# EAGLE design switching (EAGLE 7.2.0)
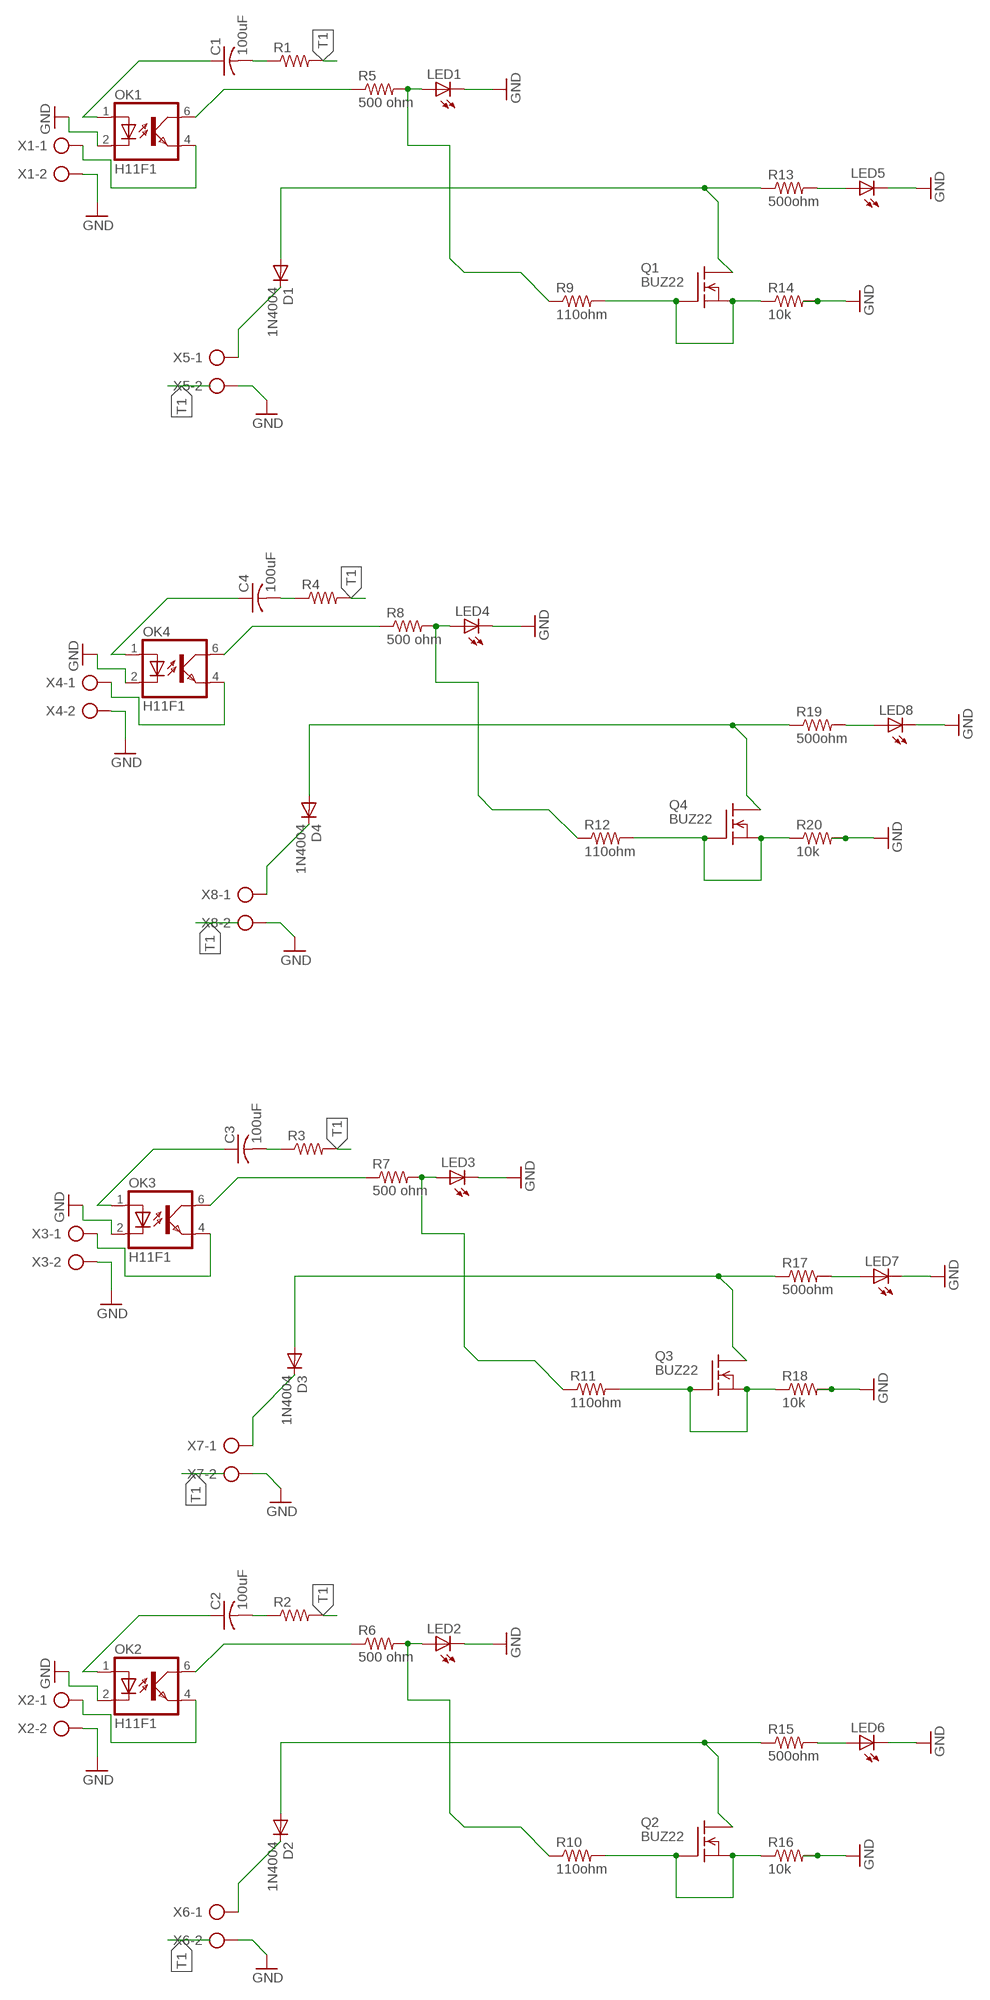
[diagram p0: schematic, sheet 1]

## Parts
C1  100uF  C-US025-024X044  [C025-024X044]
C2  100uF  C-US025-024X044  [C025-024X044]
C3  100uF  C-US025-024X044  [C025-024X044]
C4  100uF  C-US025-024X044  [C025-024X044]
D1  1N4004  [DO41-10]
D2  1N4004  [DO41-10]
D3  1N4004  [DO41-10]
D4  1N4004  [DO41-10]
LED1  LED3MM  [LED3MM]
LED2  LED3MM  [LED3MM]
LED3  LED3MM  [LED3MM]
LED4  LED3MM  [LED3MM]
LED5  LED3MM  [LED3MM]
LED6  LED3MM  [LED3MM]
LED7  LED3MM  [LED3MM]
LED8  LED3MM  [LED3MM]
OK1  H11F1  [DIL05]
OK2  H11F1  [DIL05]
OK3  H11F1  [DIL05]
OK4  H11F1  [DIL05]
Q1  BUZ22  [TO220]
Q2  BUZ22  [TO220]
Q3  BUZ22  [TO220]
Q4  BUZ22  [TO220]
R1  R-US_0204/7  [0204/7]
R2  R-US_0204/7  [0204/7]
R3  R-US_0204/7  [0204/7]
R4  R-US_0204/7  [0204/7]
R5  500 ohm  R-US_0204/7  [0204/7]
R6  500 ohm  R-US_0204/7  [0204/7]
R7  500 ohm  R-US_0204/7  [0204/7]
R8  500 ohm  R-US_0204/7  [0204/7]
R9  110ohm  R-US_0204/7  [0204/7]
R10  110ohm  R-US_0204/7  [0204/7]
R11  110ohm  R-US_0204/7  [0204/7]
R12  110ohm  R-US_0204/7  [0204/7]
R13  500ohm  R-US_0204/7  [0204/7]
R14  10k  R-US_0204/7  [0204/7]
R15  500ohm  R-US_0204/7  [0204/7]
R16  10k  R-US_0204/7  [0204/7]
R17  500ohm  R-US_0204/7  [0204/7]
R18  10k  R-US_0204/7  [0204/7]
R19  500ohm  R-US_0204/7  [0204/7]
R20  10k  R-US_0204/7  [0204/7]
X1  AK500/2  [AK500/2]
X2  AK500/2  [AK500/2]
X3  AK500/2  [AK500/2]
X4  AK500/2  [AK500/2]
X5  AK500/2  [AK500/2]
X6  AK500/2  [AK500/2]
X7  AK500/2  [AK500/2]
X8  AK500/2  [AK500/2]

## Nets
GND: LED1.K(C) LED2.K(C) LED3.K(C) LED4.K(C) LED5.K(C) LED6.K(C) LED7.K(C) LED8.K(C) OK1.2(C) OK2.2(C) OK3.2(C) OK4.2(C) R14.2 R16.2 R18.2 R20.2 X1.2 X2.2 X3.2 X4.2 X5.2 X6.2 X7.2 X8.2
N$1: OK3.4(EMIT) X3.1
N$2: OK3.6(COL) R7.1
N$3: C3.1 OK3.1(A)
N$4: LED3.A R7.2 R11.1
N$5: Q3.1(G) Q3.3(S) R11.2 R18.1
N$6: D3.A Q3.2(D) R17.1
N$7: LED7.A R17.2
N$8: D3.C X7.1
N$9: OK2.4(EMIT) X2.1
N$10: C3.2 R3.1
N$11: C2.1 OK2.1(A)
N$12: OK2.6(COL) R6.1
N$13: LED2.A R6.2 R10.1
N$14: Q2.1(G) Q2.3(S) R10.2 R16.1
N$15: D2.A Q2.2(D) R15.1
N$16: LED6.A R15.2
N$17: D2.C X6.1
N$18: C2.2 R2.1
N$19: OK4.4(EMIT) X4.1
N$20: C4.1 OK4.1(A)
N$21: OK4.6(COL) R8.1
N$22: LED4.A R8.2 R12.1
N$23: Q4.1(G) Q4.3(S) R12.2 R20.1
N$24: D4.A Q4.2(D) R19.1
N$25: LED8.A R19.2
N$26: D4.C X8.1
N$27: C4.2 R4.1
N$28: OK1.4(EMIT) X1.1
N$29: C1.1 OK1.1(A)
N$30: OK1.6(COL) R5.1
N$31: LED1.A R5.2 R9.1
N$32: Q1.1(G) Q1.3(S) R9.2 R14.1
N$33: D1.A Q1.2(D) R13.1
N$34: LED5.A R13.2
N$35: D1.C X5.1
N$36: C1.2 R1.1
T1: R1.2 R2.2 R3.2 R4.2

## Library data of the parts
C1-C4 = adafruit:C-US: CAPACITOR, American symbol; MF: AVX; MPN: 08055C104KAT2A; OC_FARNELL: 499687
D1-D4 = adafruit:1N4004: DIODE General purpose 1N400x type rectifier (With bigger pads) http://www.ladyada.net/library/pcb/eaglelibrary.html; MF: ON SEMICONDUCTOR; MPN: 1N4004G; OC_FARNELL: 1651084
LED1-LED8 = adafruit:LED: LED OSRAM: - CHIPLED LG R971, LG N971, LY N971, LG Q971, LY Q971, LO R971, LY R971 LH N974, LH R974 LS Q976, LO Q976, LY Q976 LO Q996 - Hyper CHIPLED LW Q18S LB Q993, LB Q99A, LB R99A - SideLED LS A670, LO A670, LY A670, LG A670, LP A670 LB A673, LV A673, LT A673, LW A673 LH A674 LY A675 LS A676, LA A676, LO A676, LY A676, LW A676 LS A679, LY A679, LG A679 - Hyper Micro SIDELED® LS Y876, LA Y876, LO Y876, LY Y876 LT Y87S - SmartLED LW L88C, LW L88S LB L89C, LB L89S, LG L890 LS L89K, LO L89K, LY L89K LS L896, LA L896, LO L896, LY L896 - TOPLED LS T670, LO T670, LY T670, LG T670, LP T670 LSG T670, LSP T670, LSY T670, LOP T670, LYG T670 LG T671, LOG T671, LSG T671 LB T673, LV T673, LT T673, LW T673 LH T674 LS T676, LA T676, LO T676, LY T676, LB T676, LH T676, LSB T676, LW T676 LB T67C, LV T67C, LT T67C, LS T67K, LO T67K, LY T67K, LW E67C LS E67B, LA E67B, LO E67B, LY E67B, LB E67C, LV E67C, LT E67C LW T67C LS T679, LY T679, LG T679 LS T770, LO T770, LY T770, LG T770, LP T770 LB T773, LV T773, LT T773, LW T773 LH T774 LS E675, LA E675, LY E675, LS T675 LS T776, LA T776, LO T776, LY T776, LB T776 LHGB T686 LT T68C, LB T68C - Hyper Mini TOPLED® LB M676 - Mini TOPLED Santana® LG M470 LS M47K, LO M47K, LY M47K Source: http://www.osram.convergy.de/; MF: LUMEX; MPN: SSL-LX3044LID.; OC_FARNELL: 7605511
OK1-OK4 = optocoupler:H11F1: OPTO COUPLER OPTO COUPLER; OC_FARNELL: unknown; OC_NEWARK: unknown
Q1-Q4 = transistor-fet:BUZ22: N-Channel MOSFET not checked; MF: INFINEON; MPN: IRF1310NPBF; OC_FARNELL: 9103023
R1-R4 = adafruit:R-US_: RESISTOR, American symbol; MF: YAGEO (PHYCOMP); MPN: CC0402KRX7R7BB104; OC_FARNELL: 9402047
R5-R8 R13 R15 R17 R19 = adafruit:R-US_: RESISTOR, American symbol; MF: YAGEO (PHYCOMP); MPN: CC0402JRNPO9BN101; OC_FARNELL: 3019226
R9-R12 = adafruit:R-US_: RESISTOR, American symbol; MF: PANASONIC ELECTRONIC COMPONENTS; MPN: ERJ3GEYJ111V; OC_FARNELL: 2059576
R14 R16 R18 R20 = adafruit:R-US_: RESISTOR, American symbol; MF: VISHAY; MPN: CRCW040210K0FKED; OC_FARNELL: 1469669
X1-X8 = con-ptr500:AK500/2: CONNECTOR; OC_FARNELL: unknown; OC_NEWARK: unknown

## Net classes
0 default: width 0.254 mm, drill 0.508 mm, clearance 0.254 mm

## Board
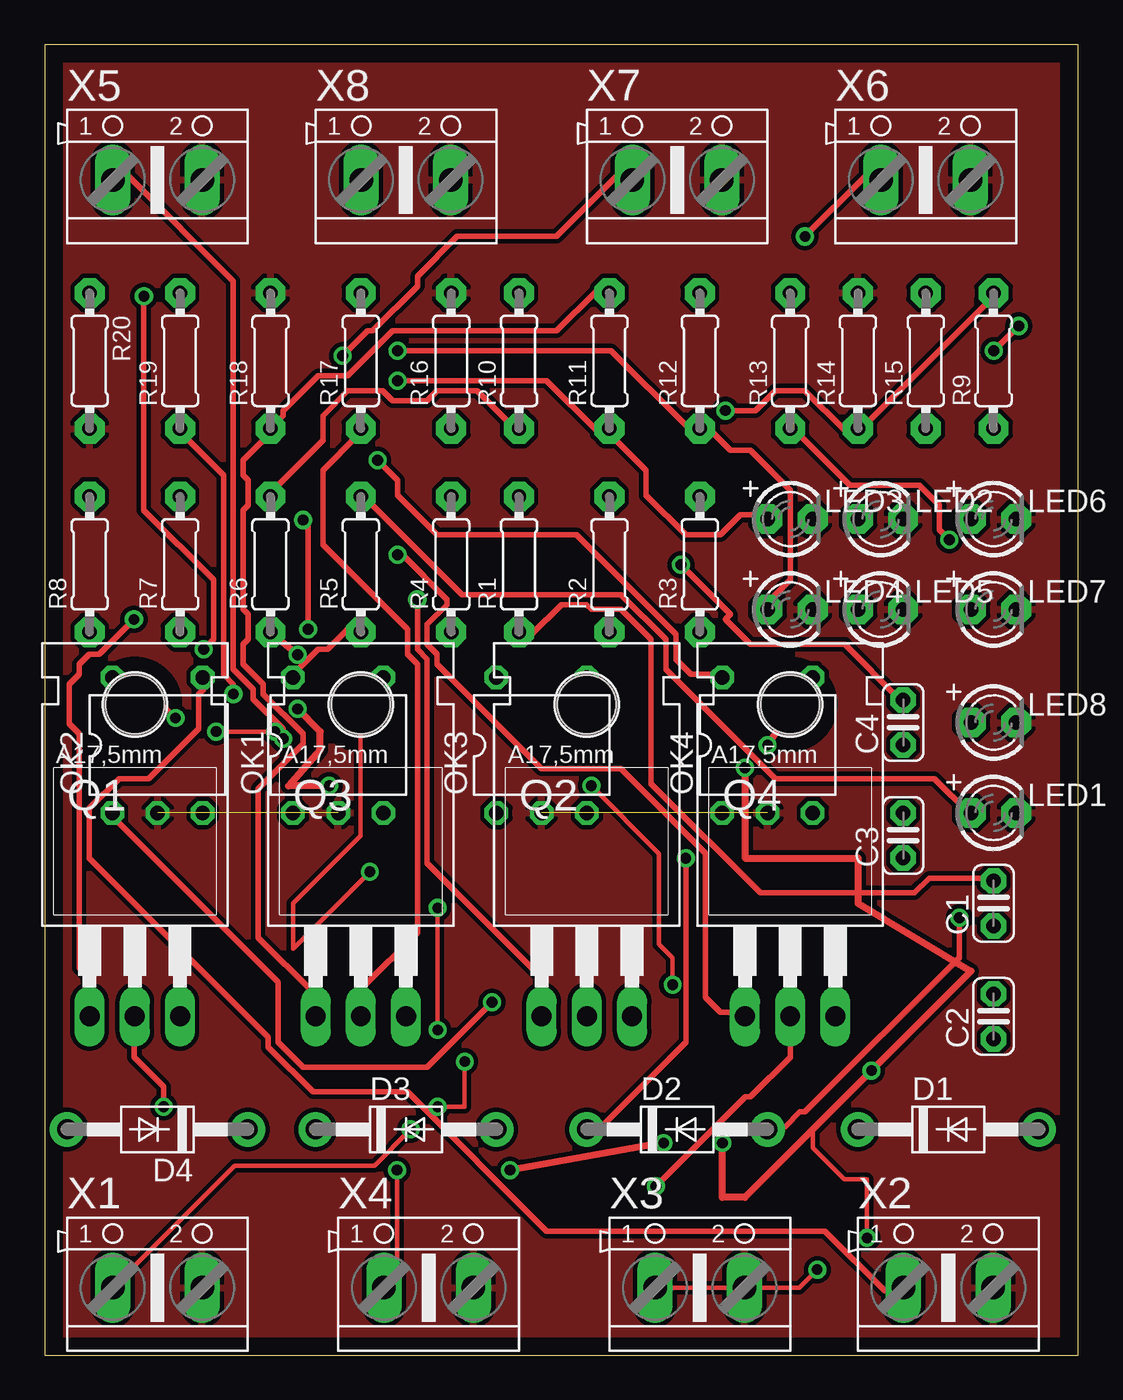
[diagram p1: board, top side]
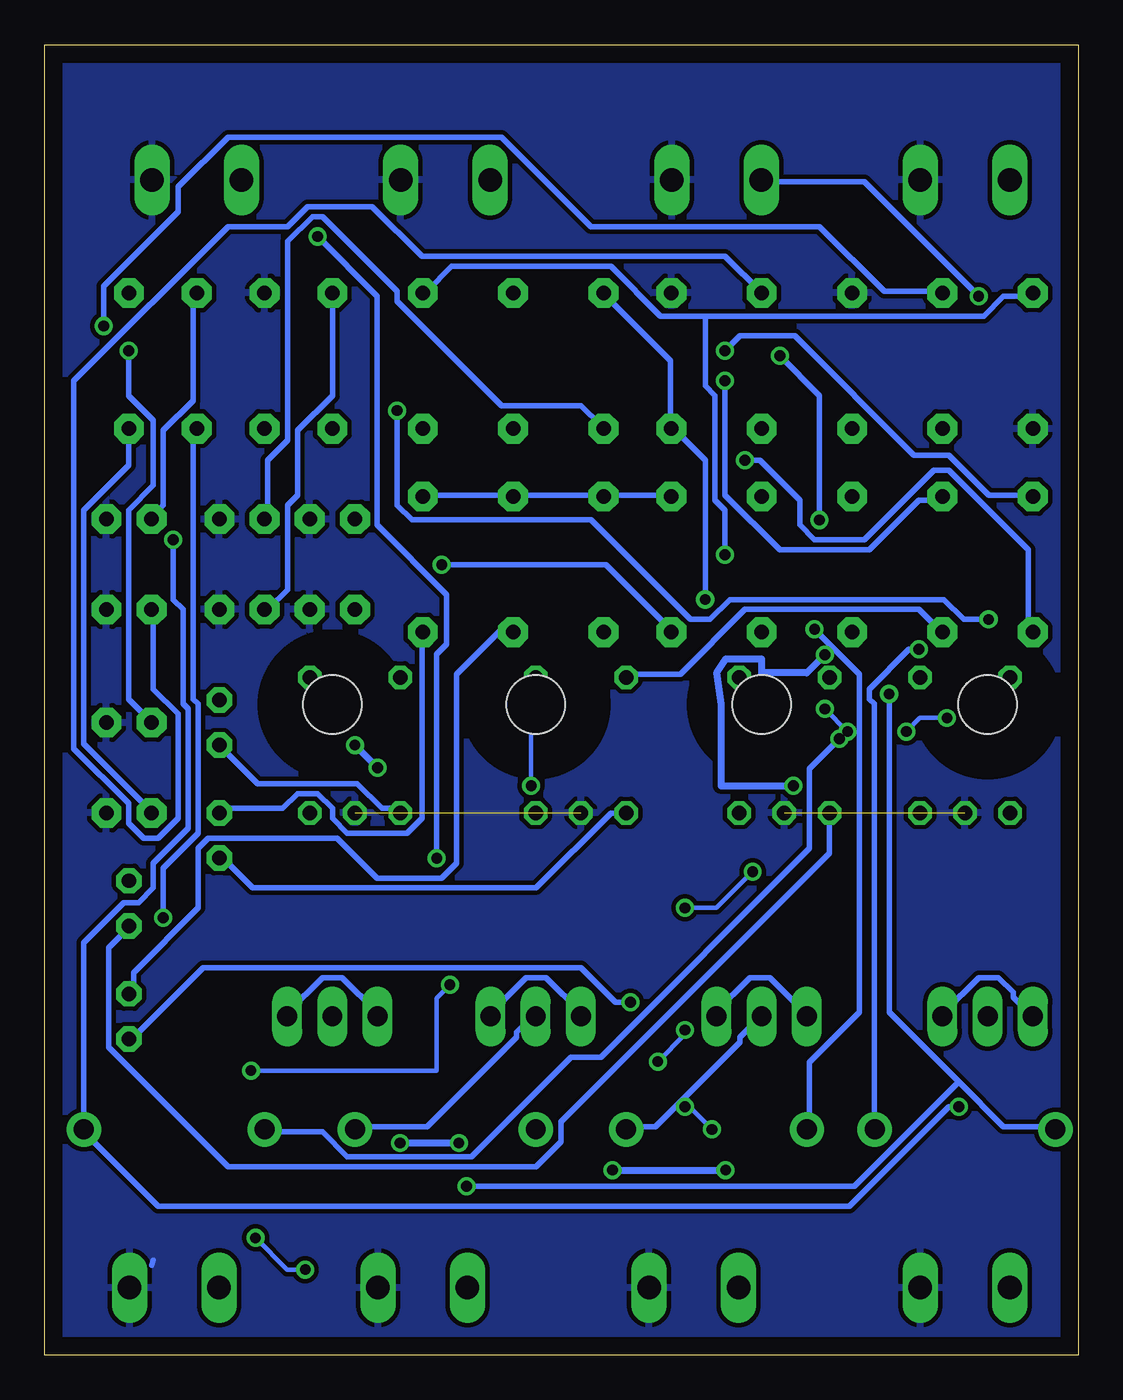
[diagram p2: board, bottom side, seen from below]

Size 58.09 x 73.65 mm. Coordinates in mm from the lower left corner, seen from the top.
Outline: 0,0 58.09,0 58.09,73.65 0,73.65 0,0
Copper layers (1*16): Top 0.035mm / dielectric 1.5mm / Bottom 0.035mm
Design rules "default": minimum track width 10mil, minimum drill 24mil, track to track 8mil, track to pad 8mil, pad to pad 8mil, via to via 8mil, smd to smd 8mil, copper to edge 40mil, drill to drill 8mil, minimum pad ring 10mil, minimum via ring 8mil, stop-mask expansion 4mil, vias tented up to drill 0mil, thermal gap 10mil

### Footprints (pad centres in the part's own frame; a part is rotated, then mirrored left to right if it is on the bottom)
C025-024X044 = drill 0.813 pad 1.422 octagon: 1 -1.27,0; 2 1.27,0
DO41-10 = drill 1.118 pad 1.93: A 5.08,0; C -5.08,0
LED3MM = drill 0.813 pad 1.676 octagon: A -1.27,0; K 1.27,0
DIL05 = drill 0.813 octagon: 1 -2.54,-3.81; 2 0,-3.81; 3 2.54,-3.81; 4 2.54,3.81; 6 -2.54,3.81
TO220 = drill 1.118 long: 1 -2.54,-6.35; 2 0,-6.35; 3 2.54,-6.35 | hole 3.302: 0,11.176
0204/7 = drill 0.813 pad 1.676 octagon: 1 -3.81,0; 2 3.81,0
AK500/2 = drill 1.321 long: 1 -2.515,0; 2 2.515,0

### Placement (x,y rotation side)
C1  53.34,25.4 90 top
C2  53.34,19.05 90 top
C3  48.26,29.21 90 top
C4  48.26,35.56 90 top
D1  50.8,12.7 0 top
D2  35.56,12.7 0 top
D3  20.32,12.7 0 top
D4  6.35,12.7 180 top
LED1  53.34,30.48 0 top
LED2  46.99,46.99 0 top
LED3  41.91,46.99 0 top
LED4  41.91,41.91 0 top
LED5  46.99,41.91 0 top
LED6  53.34,46.99 0 top
LED7  53.34,41.91 0 top
LED8  53.34,35.56 0 top
OK1  16.51,34.29 0 top
OK2  6.35,34.29 0 top
OK3  27.94,34.29 0 top
OK4  40.64,34.29 0 top
Q1  5.08,25.4 0 top
Q2  30.48,25.4 0 top
Q3  17.78,25.4 0 top
Q4  41.91,25.4 0 top
R1  26.67,44.45 90 top
R2  31.75,44.45 90 top
R3  36.83,44.45 90 top
R4  22.86,44.45 90 top
R5  17.78,44.45 90 top
R6  12.7,44.45 90 top
R7  7.62,44.45 90 top
R8  2.54,44.45 90 top
R9  53.34,55.88 90 top
R10  26.67,55.88 90 top
R11  31.75,55.88 90 top
R12  36.83,55.88 90 top
R13  41.91,55.88 90 top
R14  45.72,55.88 90 top
R15  49.53,55.88 90 top
R16  22.86,55.88 90 top
R17  17.78,55.88 90 top
R18  12.7,55.88 90 top
R19  7.62,55.88 90 top
R20  2.54,55.88 270 top
X1  6.35,3.81 0 top
X2  50.8,3.81 0 top
X3  36.83,3.81 0 top
X4  21.59,3.81 0 top
X5  6.35,66.04 0 top
X6  49.53,66.04 0 top
X7  35.56,66.04 0 top
X8  20.32,66.04 0 top

### Tracks (layer width: path | path; a pad name or v marks a point on that pad's centre or on a via)
GND  (2 unrouted)
  Bottom 0.305: 52.07,5.08 51.97,5.36
  pour Top: -1.27,74.93 59.69,74.93 59.69,-1.27 -1.27,-1.27
  pour Bottom: -3.81,74.93 60.96,74.93 60.96,-2.54 -3.81,-2.54
N$1  (via drill 0.6)
  Top 0.254: X3.1 42.42,3.81 v43.43,4.83 | v46.23,6.6 46.23,9.91 44.96,9.91 43.18,11.68 43.18,12.7 v46.48,16 | v35.31,20.83 35.31,22.35 34.54,23.11 34.54,28.19 v30.73,32
  Bottom 0.254: v43.43,4.83 44.45,4.83 v46.23,6.6 | v46.48,16 36.07,16 36.07,20.07 v35.31,20.83 | v30.73,32 30.73,37.85 OK3.4
N$2
  Bottom 0.305: OK3.6 25.15,38.28 22.35,38.28 18.72,41.91 8.94,41.91 7.82,40.79 R7.1
N$3
  Bottom 0.305: OK3.1 25.43,30.45 26.26,30.45 30.45,26.26 46.38,26.26 48.06,27.94 C3.1
N$4  (via drill 0.61)
  Top 0.305: v19.84,54.76 28.22,54.76 31.01,51.97 31.57,51.97 | 31.57,51.97 33.81,49.73 33.81,48.34 36.04,46.1 38,46.1 39.12,47.22 40.51,47.22 LED3.A | 31.57,51.97 R11.1
  Bottom 0.305: v19.84,54.76 19.84,48.34 16.76,45.26 11.73,45.26 8.94,48.06 7.82,48.06 R7.2
N$5
  Top 0.305: R11.2 31.57,59.79 31.01,59.79 28.78,57.56 19.56,57.56 17.04,55.04 15.37,55.04 13.41,53.09 13.41,52.81 12.85,52.25 R18.1 12.85,51.97 11.18,50.29 11.18,49.45 11.46,49.17 11.46,47.78 11.18,47.5 11.18,41.91 11.46,41.63 11.46,40.23 11.18,39.95 11.18,38.84 12.29,37.72 12.29,37.16 14.53,34.92 14.53,34.37 12.01,31.85 12.01,23.47 15.09,20.4 15.09,19.28 Q3.1
  Bottom 0.305: Q3.1 15.37,19.28 17.32,21.23 18.44,21.23 20.4,19.28 Q3.3
N$6
  Top 0.305: R17.1 17.6,51.97 17.6,51.69 15.65,49.73 15.65,45.54 20.4,40.79 20.4,39.4 20.95,38.84 20.95,23.75 17.88,20.68 17.88,19.28 Q3.2
  Bottom 0.305: Q3.2 17.88,19 19,17.88 19,17.6 23.75,12.85 25.15,12.85 D3.A
N$7
  Bottom 0.305: R17.2 19.84,61.75 36.88,61.75 39.67,64.54 43.31,64.54 44.42,63.42 47.78,63.42 56.44,54.76 56.44,34.09 53.37,31.01 53.37,29.9 52.53,29.06 51.69,29.06 50.57,30.18 50.57,36.04 51.97,37.44 51.97,41.91 LED7.A
N$8  (via drill 0.61)
  Top 0.305: v14.81,40.79 14.81,46.66 v14.53,46.94 | v16.76,56.16 18.16,57.56 18.44,57.56 20.95,60.07 20.95,60.63 23.19,62.87 28.78,62.87 32.13,66.22 32.97,66.22 X7.1
  Bottom 0.305: v14.81,40.79 12.29,38.28 12.29,19.28 15.09,16.48 15.09,12.85 D3.C | v14.53,46.94 14.53,53.92 v16.76,56.16
N$9
  Top 0.305: OK2.4 8.94,38 8.94,37.44 8.66,37.16 8.66,35.2 5.87,32.41 4.19,32.41 2.52,30.73 2.52,27.94 12.57,17.88 12.57,17.32 15.09,14.81 20.4,14.81 28.22,6.99 43.87,6.99 47.22,3.63 48.06,3.63 X2.1
N$10
  Bottom 0.305: C3.2 48.06,30.73 44.7,30.73 43.87,31.57 42.75,31.57 41.91,30.73 41.91,30.18 41.07,29.34 37.72,29.34 36.88,30.18 36.88,40.51 R3.1
N$11  (via drill 0.61)
  Top 0.305: v25.15,19.84 21.51,16.2 14.53,16.2 13.13,17.6 13.13,20.95 3.91,30.18 3.91,30.45 OK2.1
  Bottom 0.305: v25.15,19.84 25.98,19.84 27.94,21.79 49.17,21.79 53.09,17.88 C2.1
N$12  (via drill 0.6)
  Top 0.254: v12.95,35.05 v9.65,35.05 | v7.37,35.81 5.08,38.1 OK2.6
  Top 0.406: R6.1 v14.22,39.37 | v16,32 13.72,32 15.49,34.04 15.49,35.05 v14.22,36.32
  Bottom 0.254: v14.22,36.32 v12.95,35.05 | v9.65,35.05 8.89,35.81 v7.37,35.81
  Bottom 0.406: v14.22,39.37 15.24,38.35 17.78,38.35 17.78,39.12 19.81,39.12 20.32,38.35 20.07,36.58 20.07,32 v16,32
N$13
  Top 0.305: R6.2 12.85,48.34 12.85,48.62 15.65,51.41 15.65,52.81 17.04,54.2 19,54.2 19.56,53.65 21.51,53.65 22.07,54.2 24.31,54.2 26.54,51.97 R10.1
  Bottom 0.305: LED2.A 45.54,47.22 45.54,50.29 44.42,51.41 44.42,62.59 43.03,63.98 42.47,63.98 38.28,59.79 38.28,59.23 32.41,53.37 27.94,53.37 26.82,52.25 R10.1
N$14  (via drill 0.61)
  Top 0.305: Q2.1 27.94,21.23 21.51,27.66 21.51,39.12 20.95,39.67 v20.95,42.47
  Bottom 0.305: Q2.1 27.94,19.28 29.9,21.23 31.01,21.23 32.97,19.28 Q2.3 | R10.2 26.54,59.51 22.91,55.88 22.91,52.25 R16.1 22.63,51.97 20.95,50.29 v20.95,42.47
N$15  (via drill 0.61)
  Top 0.305: v51.41,24.59 51.41,22.35 42.75,13.69 42.47,13.69 41.63,12.85 40.79,12.85 D2.A
  Bottom 0.305: Q2.2 30.73,19 31.57,18.16 31.57,17.88 36.6,12.85 40.51,12.85 D2.A | v51.41,24.59 51.41,27.38 49.45,29.34 49.45,36.6 49.73,36.88 49.73,51.97 R15.1
N$16
  Bottom 0.305: R15.2 49.73,59.51 49.73,53.65 51.41,51.97 51.41,47.78 51.97,47.22 LED6.A
N$17  (via drill 0.61)
  Top 0.305: v36.04,27.94 36.04,17.6 31.29,12.85 30.73,12.85 D2.C | v42.75,62.87 46.1,66.22 46.94,66.22 X6.1
  Bottom 0.305: v36.04,27.94 36.04,39.4 35.48,39.95 35.48,42.75 39.4,46.66 39.4,59.51 v42.75,62.87
N$18
  Bottom 0.305: C2.2 53.09,20.4 53.09,21.51 49.45,25.15 49.45,28.5 48.9,29.06 41.63,29.06 39.4,26.82 35.76,26.82 34.92,27.66 34.92,38.28 32.41,40.79 31.85,40.79 R2.1
N$19  (via drill 0.6)
  Top 0.254: v19.81,10.41 19.81,4.55 X4.1
  Top 0.406: OK4.4 v40.64,34.29 | v39.37,33.02 39.37,27.94 45.72,27.94 45.72,25.4 52.07,21.59 39.37,8.89 38.1,8.89 v38.1,11.94 | v34.8,11.94 v26.16,10.41
  Bottom 0.406: v40.64,34.29 v39.37,33.02 | v38.1,11.94 v34.8,11.94 | v26.16,10.41 v19.81,10.41
N$20
  Bottom 0.305: C4.1 46.1,32.13 40.51,32.13 39.12,30.73 38.28,30.73 OK4.1
N$21  (via drill 0.61)
  Top 0.305: v18.72,50.29 19.84,49.17 19.84,48.34 22.07,46.1 29.9,46.1 35.48,40.51 35.48,39.12 36.32,38.28 38,38.28 OK4.6
  Bottom 0.305: v18.72,50.29 17.88,50.29 15.65,48.06 15.65,46.66 14.81,45.82 12.01,45.82 8.1,49.73 7.26,49.73 2.79,45.26 2.79,40.79 R8.1
N$22  (via drill 0.61)
  Top 0.305: v19.84,56.44 31.85,56.44 36.04,52.25 36.6,52.25 R12.1 36.88,51.97 37.44,51.97 38.56,50.85 39.67,50.85 41.91,48.62 41.91,43.59 40.79,42.47 40.79,41.91 LED4.A
  Bottom 0.305: v19.84,56.44 19,57.28 15.93,57.28 9.22,50.57 7.26,50.57 5.03,48.34 2.79,48.34 R8.2
N$23  (via drill 0.61)
  Top 0.305: v19.84,44.98 20.12,44.98 22.63,42.47 22.63,42.19 21.51,41.07 21.51,39.95 22.07,39.4 22.07,38.84 27.94,32.97 32.41,32.97 37.16,28.22 37.16,20.12 38,19.28 39.12,19.28 Q4.1
  Bottom 0.305: Q4.1 39.4,19.28 41.35,21.23 42.47,21.23 44.42,19.28 Q4.3 | 20.95,58.4 23.47,58.4 26.26,61.19 35.2,61.19 36.6,59.79 R12.2 | 20.95,58.4 5.31,58.4 4.19,59.51 2.79,59.51 R20.1 | v19.84,44.98 19.84,47.5 20.4,48.06 20.4,53.92 20.95,54.48 20.95,58.4
N$24  (via drill 0.61)
  Top 0.305: v10.62,37.16 10.62,37.72 10.06,38.28 10.06,49.45 7.82,51.69 7.82,51.97 R19.1 | Q4.2 41.91,16.76 39.67,14.53 39.4,14.53 v34.37,9.5
  Bottom 0.305: v10.62,37.16 10.62,19.28 6.71,15.37 | 6.71,15.37 4.19,12.85 1.4,12.85 D4.A | v34.37,9.5 12.57,9.5 6.71,15.37
N$25  (via drill 0.61)
  Top 0.305: v53.37,56.44 v54.76,57.84
  Bottom 0.305: v54.76,57.84 54.76,60.07 50.57,64.26 50.57,65.66 47.78,68.45 32.41,68.45 27.38,63.42 14.53,63.42 10.9,59.79 7.82,59.79 R19.2 | v53.37,56.44 53.37,53.92 51.97,52.53 51.97,48.9 53.37,47.5 53.37,36.88 52.25,35.76 LED8.A
N$26  (via drill 0.61)
  Top 0.305: v8.94,39.67 9.5,40.23 9.5,43.59 5.59,47.5 v5.59,59.51
  Bottom 0.305: v8.94,39.67 9.5,39.67 11.73,37.44 11.73,36.88 11.46,36.6 11.46,12.85 D4.C | v5.59,59.51 12.01,65.94 17.6,65.94 X8.1
N$27  (via drill 0.61)
  Top 0.305: v35.76,44.42 38.56,41.63 38.28,41.35 39.67,39.95 44.98,39.95 48.06,36.88 C4.2
  Bottom 0.305: v35.76,44.42 26.54,44.42 22.91,40.79 R4.1
N$28  (via drill 0.6)
  Top 0.254: OK1.4 17.78,36.83 17.78,29.21 13.97,25.4 13.97,22.86 v18.29,27.18 | X1.1 10.69,10.67 18.54,10.67 v20.57,12.7 | v22.1,13.97 23.62,13.97 v23.62,16.51 | v22.1,18.29 v22.1,25.15
  Bottom 0.254: v20.57,12.7 21.84,13.97 v22.1,13.97 | v23.62,16.51 22.1,18.03 v22.1,18.29 | v22.1,25.15 20.32,25.15 v18.29,27.18
N$29
  Bottom 0.305: OK1.1 13.97,28.22 29.06,13.13 29.06,12.01 30.45,10.62 47.78,10.62 54.48,17.32 54.48,22.91 53.37,24.03 C1.1
N$30
  Top 0.305: OK1.6 13.97,38.28 15.37,39.67 15.93,39.67 17.04,40.79 17.6,40.79 R5.1
N$31
  Top 0.305: R5.2 17.88,48.06 18.16,48.06 23.47,42.75 32.41,42.75 34.92,40.23 34.92,38.56 41.07,32.41 50.01,32.41 51.97,30.45 LED1.A
  Bottom 0.305: R9.1 53.37,51.97 53.37,50.01 55.88,47.5 55.88,34.37 52.25,30.73 LED1.A
N$32  (via drill 0.61)
  Top 0.305: R9.2 53.37,59.51 46.1,52.25 45.82,52.25 R14.1 45.54,51.97 44.98,51.97 42.75,54.2 41.07,54.2 39.95,53.09 v38.28,53.09 | v5.03,41.35 3.07,39.4 2.52,39.4 1.96,38.84 1.96,38.28 1.4,37.72 1.4,35.48 1.96,34.92 1.96,21.79 2.52,21.23 2.52,19.28 Q1.1
  Bottom 0.305: Q1.1 2.79,19.28 3.63,20.12 3.63,20.4 4.47,21.23 5.59,21.23 7.54,19.28 Q1.3 | v5.03,41.35 6.43,41.35 7.54,42.47 19.56,42.47 20.68,41.35 21.79,41.35 27.38,46.94 37.44,46.94 38.28,47.78 v38.28,53.09
N$33  (via drill 0.61)
  Top 0.305: v6.71,13.97 6.71,15.09 5.03,16.76 5.03,19 Q1.2 | v50.85,45.82 50.29,46.38 50.29,47.78 49.17,48.9 45.26,48.9 42.19,51.97 41.91,51.97 R13.1
  Bottom 0.305: v6.71,13.97 7.26,13.97 12.85,8.38 51.69,8.38 55.88,12.57 D1.A 55.88,23.19 53.65,25.43 52.81,25.43 51.97,26.26 51.97,27.66 50.01,29.62 50.01,36.32 50.29,36.6 50.29,41.91 50.85,42.47 v50.85,45.82
N$34
  Bottom 0.305: R13.2 41.91,53.92 43.87,51.97 43.87,48.34 44.42,47.78 44.42,43.03 45.54,41.91 LED5.A
N$35  (via drill 0.61)
  Top 0.305: v13.41,34.65 13.41,35.2 11.73,36.88 11.73,37.44 10.62,38.56 10.62,60.35 4.75,66.22 3.91,66.22 X5.1
  Bottom 0.305: v13.41,34.65 15.09,32.97 15.09,28.5 26.82,16.76 28.5,16.76 34.09,11.18 41.07,11.18 42.47,12.57 45.54,12.57 D1.C
N$36
  Top 0.305: C1.2 53.09,26.82 49.73,26.82 48.9,25.98 40.23,25.98 34.09,32.13 34.09,40.23 32.41,41.91 30.73,41.91 30.45,42.19 29.06,42.19 27.38,40.51 26.82,40.51 R1.1
T1
  Bottom 0.305: R4.2 22.91,48.34 26.54,48.34 R1.2 26.82,48.34 31.57,48.34 R2.2 31.85,48.34 36.6,48.34 R3.2